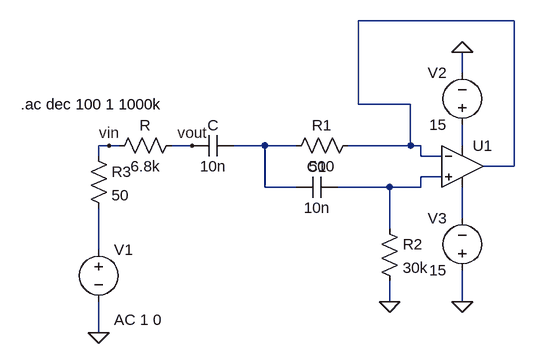
[diagram p0: schematic BR rama.asc]
BR rama.asc, the LTspice schematic file:
Version 4
SHEET 1 880 680
WIRE 752 -80 512 -80
WIRE 672 0 672 -32
WIRE 512 48 512 -80
WIRE 592 48 512 48
WIRE 128 112 112 112
WIRE 144 112 128 112
WIRE 256 112 224 112
WIRE 368 112 320 112
WIRE 416 112 368 112
WIRE 592 112 592 48
WIRE 592 112 496 112
WIRE 608 112 592 112
WIRE 672 112 672 80
WIRE 112 128 112 112
WIRE 608 128 608 112
WIRE 640 128 608 128
WIRE 752 144 752 -80
WIRE 752 144 704 144
WIRE 640 160 608 160
WIRE 368 176 368 112
WIRE 416 176 368 176
WIRE 560 176 480 176
WIRE 608 176 608 160
WIRE 608 176 560 176
WIRE 672 224 672 176
WIRE 560 240 560 176
WIRE 112 272 112 208
WIRE 560 352 560 320
WIRE 672 352 672 304
WIRE 112 400 112 352
FLAG 128 112 vin
FLAG 560 352 0
FLAG 112 400 0
FLAG 672 -32 0
FLAG 672 352 0
FLAG 256 112 vout
SYMBOL res 240 96 R90
WINDOW 0 0 56 VBottom 2
WINDOW 3 32 56 VTop 2
SYMATTR InstName R
SYMATTR Value 6.8k
SYMBOL cap 256 128 R270
WINDOW 0 32 32 VTop 2
WINDOW 3 0 32 VBottom 2
SYMATTR InstName C
SYMATTR Value 10n
SYMBOL voltage 112 256 R0
WINDOW 123 24 124 Left 2
WINDOW 39 0 0 Left 2
SYMATTR Value2 AC 1 0
SYMATTR InstName V1
SYMATTR Value ""
SYMBOL res 512 96 R90
WINDOW 0 0 56 VBottom 2
WINDOW 3 32 56 VTop 2
SYMATTR InstName R1
SYMATTR Value 500
SYMBOL res 544 224 R0
SYMATTR InstName R2
SYMATTR Value 30k
SYMBOL cap 480 160 R90
WINDOW 0 0 32 VBottom 2
WINDOW 3 32 32 VTop 2
SYMATTR InstName C1
SYMATTR Value 10n
SYMBOL Opamps\\UniversalOpamp2 672 144 R0
SYMATTR InstName U1
SYMBOL voltage 672 96 R180
WINDOW 0 24 96 Left 2
WINDOW 3 24 16 Left 2
WINDOW 123 0 0 Left 2
WINDOW 39 0 0 Left 2
SYMATTR InstName V2
SYMATTR Value 15
SYMBOL voltage 672 320 R180
WINDOW 0 24 96 Left 2
WINDOW 3 24 16 Left 2
WINDOW 123 0 0 Left 2
WINDOW 39 0 0 Left 2
SYMATTR InstName V3
SYMATTR Value 15
SYMBOL res 96 112 R0
SYMATTR InstName R3
SYMATTR Value 50
TEXT -8 48 Left 2 !.ac dec 100 1 1000k

The netlist it stands for:
* BR rama.asc
R vout vin 6.8k
C vout N002 10n
V1 N006 0 AC 1 0
R1 N001 N002 500
R2 N004 0 30k
C1 N004 N002 10n
XU1 N004 N001 N003 N005 N001 level.2 Avol=1Meg GBW=10Meg Slew=10Meg ilimit=25m rail=0 Vos=0 phimargin=45 en=0 enk=0 in=0 ink=0 Rin=500Meg  ; pins IN+ IN- V+ V- OUT
V2 N003 0 15
V3 0 N005 15
R3 vin N006 50
.ac dec 100 1 1000k
.lib UniversalOpamps2.sub
.backanno
.end